# EAGLE design relay board (EAGLE 6.3)
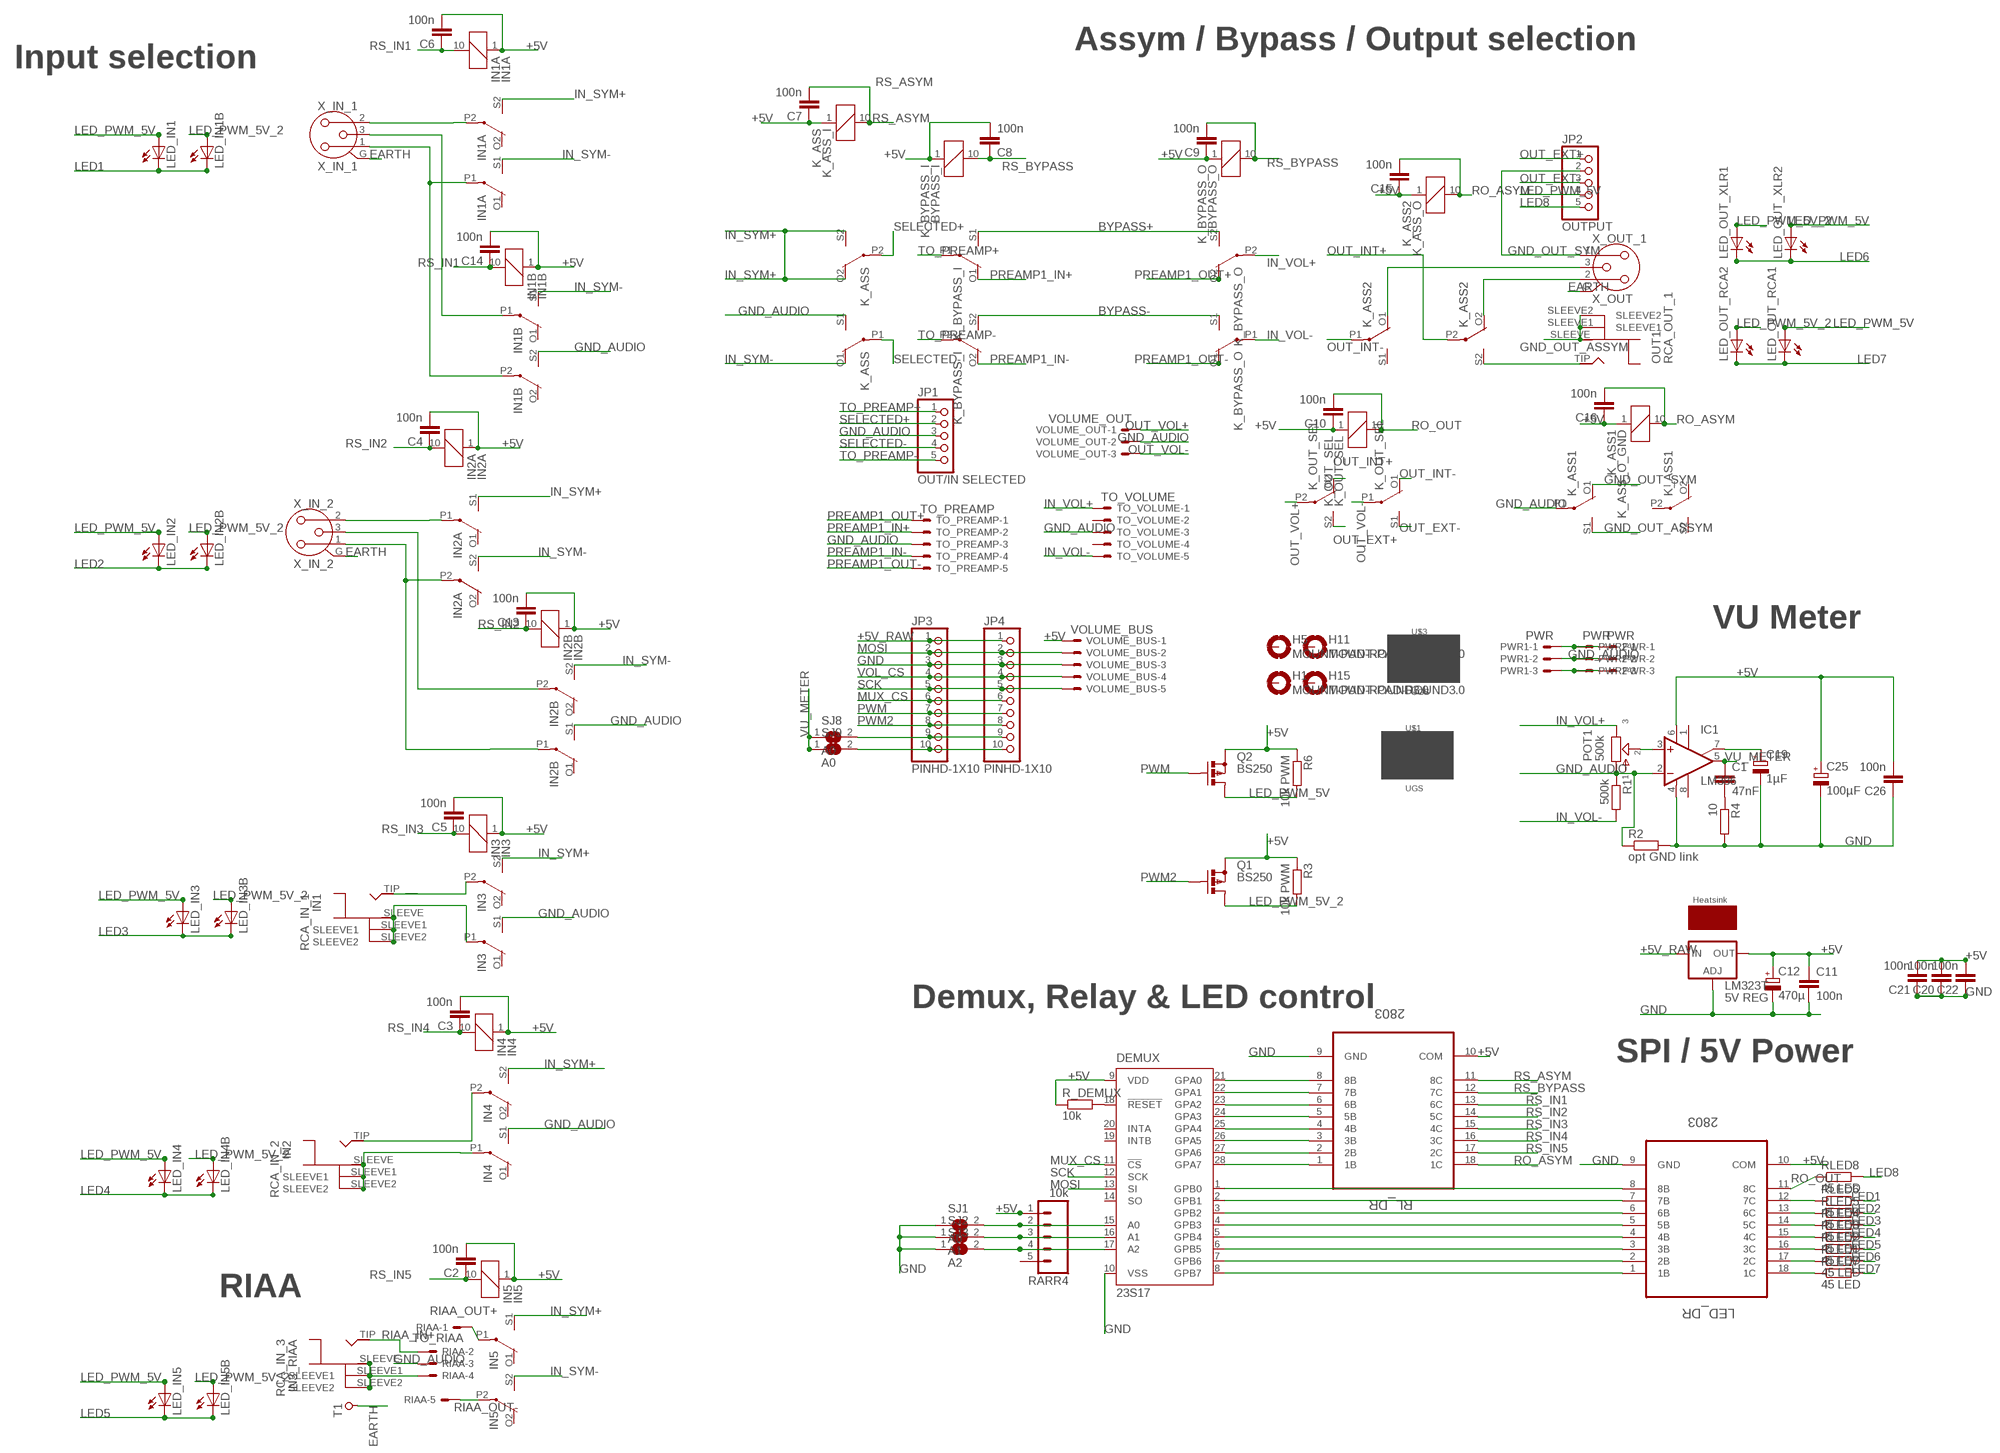
[diagram p0: schematic, sheet 1]

## Parts
C1  47nF  C5/3  [C5B3]
C2  100n  C-EU050-025X075  [C050-025X075]
C3  100n  C-EU050-025X075  [C050-025X075]
C4  100n  C-EU050-025X075  [C050-025X075]
C5  100n  C-EU050-025X075  [C050-025X075]
C6  100n  C-EU050-025X075  [C050-025X075]
C7  100n  C-EU050-025X075  [C050-025X075]
C8  100n  C-EU050-025X075  [C050-025X075]
C9  100n  C-EU050-025X075  [C050-025X075]
C10  100n  C-EU050-025X075  [C050-025X075]
C11  100n  C-EU050-025X075  [C050-025X075]
C12  470µ  CPOL-EUE2.5-6  [E2,5-6]
C13  100n  C-EU050-025X075  [C050-025X075]
C14  100n  C-EU050-025X075  [C050-025X075]
C15  100n  C-EU050-025X075  [C050-025X075]
C16  100n  C-EU050-025X075  [C050-025X075]
C19  1µF  CPOL-EUE2.5-5  [E2,5-5]
C20  100n  C-EU050-025X075  [C050-025X075]
C21  100n  C-EU050-025X075  [C050-025X075]
C22  100n  C-EU050-025X075  [C050-025X075]
C25  100µF  CPOL-EUE5-6  [E5-6]
C26  100n  C-EU050-025X075  [C050-025X075]
DEMUX  23S17  MCP23S17SO  [SO28W]
H1  MOUNT-PAD-ROUND3.0  [3,0-PAD]
H5  MOUNT-PAD-ROUND3.0  [3,0-PAD]
H11  MOUNT-PAD-ROUND3.0  [3,0-PAD]
H15  MOUNT-PAD-ROUND3.0  [3,0-PAD]
IC1  LM386  [DIL08]
IN1A  IN1A  G6H2-100  [G6H2-100]
IN1B  IN1B  G6H2-100  [G6H2-100]
IN2A  IN2A  G6H2-100  [G6H2-100]
IN2B  IN2B  G6H2-100  [G6H2-100]
IN3  IN3  G6H2-100  [G6H2-100]
IN4  IN4  G6H2-100  [G6H2-100]
IN5  IN5  G6H2-100  [G6H2-100]
JP1  OUT/IN SELECTED  PINHD-1X5  [1X05]
JP2  OUTPUT  PINHD-1X5  [1X05]
JP3  PINHD-1X10  [1X10-BIG]
JP4  PINHD-1X10  [1X10-BIG]
K_ASS  K_ASS_I  G6H2-100  [G6H2-100]
K_ASS1  K_ASS_O_GND  G6H2-100  [G6H2-100]
K_ASS2  K_ASS_O  G6H2-100  [G6H2-100]
K_BYPASS_I  BYPASS_I  G6H2-100  [G6H2-100]
K_BYPASS_O  BYPASS_O  G6H2-100  [G6H2-100]
K_OUT_SEL  K_OUT_SEL  G6H2-100  [G6H2-100]
LED_DR  2803  ULN2803ADWR  [SOIC127P1030X265-18N]
LED_IN1  TLLG4400  [LED3MM]
LED_IN1B  TLLG4400  [LED3MM]
LED_IN2  TLLG4400  [LED3MM]
LED_IN2B  TLLG4400  [LED3MM]
LED_IN3  TLLG4400  [LED3MM]
LED_IN3B  TLLG4400  [LED3MM]
LED_IN4  TLLG4400  [LED3MM]
LED_IN4B  TLLG4400  [LED3MM]
LED_IN5  TLLG4400  [LED3MM]
LED_IN5B  TLLG4400  [LED3MM]
LED_OUT_RCA1  TLLG4400  [LED3MM]
LED_OUT_RCA2  TLLG4400  [LED3MM]
LED_OUT_XLR1  TLLG4400  [LED3MM]
LED_OUT_XLR2  TLLG4400  [LED3MM]
LM323T  5V REG  LM138-TSTO220S_IAO  [TO220S]
POT1  500k  POT-EU25  [B25P]
PWR  PWR  C-GRID-03-70543  [70543-03]
PWR1  PWR  C-GRID-03-70543  [70543-03]
PWR2  PWR  C-GRID-03-70543  [70543-03]
Q1  BS250  [SOT54E]
Q2  BS250  [SOT54E]
R1  500k  R-EU_0207/7  [0207/7]
R2  opt GND link  R-EU_0207/10  [0207/10]
R3  10k PWM  R-EU_0207/10  [0207/10]
R4  10  R-EU_0207/10  [0207/10]
R6  10k PWM  R-EU_0207/10  [0207/10]
R_DEMUX  10k  RESISTOR-PTH-0.4  [RTH025W]
RARR4  10k  M05PTH  [1X05]
RCA_IN_1  IN1  MONO_JACKGAEL  [MONO_JACK]
RCA_IN_2  IN2  MONO_JACKGAEL  [MONO_JACK]
RCA_IN_3  IN3_RIAA  MONO_JACKGAEL  [MONO_JACK]
RCA_OUT_1  OUT1  MONO_JACKGAEL  [MONO_JACK]
RIAA  TO_RIAA  C-GRID-05-70543  [70543-05]
RL_DR  2803  ULN2803ADWR  [SOIC127P1030X265-18N]
RLED1  45 LED  R-EU_0207/10  [0207/10]
RLED2  45 LED  R-EU_0207/10  [0207/10]
RLED3  45 LED  R-EU_0207/10  [0207/10]
RLED4  45 LED  R-EU_0207/10  [0207/10]
RLED5  45 LED  R-EU_0207/10  [0207/10]
RLED6  45 LED  R-EU_0207/10  [0207/10]
RLED7  45 LED  R-EU_0207/10  [0207/10]
RLED8  45 LED  R-EU_0207/10  [0207/10]
SJ1  A0  SJ  [SJ]
SJ2  A1  SJ  [SJ]
SJ3  A2  SJ  [SJ]
SJ8  A0  SJ  [SJ]
SJ9  A0  SJ  [SJ]
T1  PAD_TERMINAL-1.02MM_SQUARE  [CON_PAD_SQUARE_1.02MM]
TO_PREAMP  TO_PREAMP  C-GRID-05-70543  [70543-05]
TO_VOLUME  TO_VOLUME  C-GRID-05-70543  [70543-05]
U$1  UGS  [UGS]
U$3  UGS  [UGS]
U$4  HEATSINK  [HEATSINK]
VOLUME_BUS  VOLUME_BUS  C-GRID-05-70543  [70543-05]
VOLUME_OUT  VOLUME_OUT  C-GRID-03-70543  [70543-03]
X_IN_1  X_IN_1  NC3FAH2  [NC3FAH2]
X_IN_2  X_IN_2  NC3FAH2  [NC3FAH2]
X_OUT_1  X_OUT  NC3MBH  [NC3MBH]

## Nets
+5V [power]: C2.2 C3.2 C4.2 C5.2 C6.2 C7.1 C8.2 C9.1 C10.1 C11.1 C12.+ C13.2 C14.2 C15.1 C16.1 C20.2 C21.2 C22.2 C25.+ C26.2 DEMUX.9(VDD) IC1.6(V+) IN1A.1 IN1B.1 IN2A.1 IN2B.1 IN3.1 IN4.1 IN5.1 K_ASS1.1 K_ASS2.1 K_ASS.1 K_BYPASS_I.1 K_BYPASS_O.1 K_OUT_SEL.1 LED_DR.10(COM) LM323T.3(OUT) Q1.S Q2.S R3.1 R6.1 R_DEMUX.1 RARR4.1 RL_DR.10(COM) VOLUME_BUS.1
+5V_RAW [power]: JP3.1 JP4.1 LM323T.1(IN)
BYPASS+ [power]: K_BYPASS_I.S1(2:S) K_BYPASS_O.S2(3:S)
BYPASS- [power]: K_BYPASS_I.S2(3:S) K_BYPASS_O.S1(2:S)
EARTH: T1.P X_IN_1.G X_IN_2.G X_OUT_1.G
GND [power]: C11.2 C12.- C19.- C20.1 C21.1 C22.1 C25.- C26.1 DEMUX.10(VSS) IC1.4(V-) JP3.3 JP4.3 LED_DR.9(GND) LM323T.2(ADJ) R2.2 R4.2 RL_DR.9(GND) SJ1.1 SJ2.1 SJ3.1 VOLUME_BUS.3
GND_AUDIO [power]: IC1.2(-IN) IN1B.S2(3:S) IN2B.S1(2:S) IN3.S1(2:S) IN4.S1(2:S) JP1.3 K_ASS1.P1(2:P) K_ASS.S1(2:S) POT1.1 PWR1.2 PWR2.2 PWR.2 R1.1 R2.1 RIAA.3 TO_PREAMP.3 TO_VOLUME.3 VOLUME_OUT.2
GND_IN_RIAA [power]: RCA_IN_3.SLEEVE RCA_IN_3.SLEEVE1 RCA_IN_3.SLEEVE2 RIAA.4
GND_OUT_ASSYM [power]: K_ASS1.S1(2:S) RCA_OUT_1.SLEEVE RCA_OUT_1.SLEEVE1 RCA_OUT_1.SLEEVE2
GND_OUT_SYM [power]: JP2.2 K_ASS1.O1(2:O) X_OUT_1.1
IN_SYM+ [power]: IN1A.S2(3:S) IN2A.S1(2:S) IN3.S2(3:S) IN4.S2(3:S) IN5.S1(2:S) K_ASS.O2(3:O) K_ASS.S2(3:S)
IN_SYM- [power]: IN1A.S1(2:S) IN1B.S1(2:S) IN2A.S2(3:S) IN2B.S2(3:S) IN5.S2(3:S) K_ASS.O1(2:O)
IN_VOL+ [power]: K_BYPASS_O.P2(3:P) POT1.3 TO_VOLUME.1
IN_VOL- [power]: K_BYPASS_O.P1(2:P) R1.2 TO_VOLUME.5
LED1: LED_IN1.K(C) LED_IN1B.K(C) RLED6.2
LED2: LED_IN2.K(C) LED_IN2B.K(C) RLED5.2
LED3: LED_IN3.K(C) LED_IN3B.K(C) RLED4.2
LED4: LED_IN4.K(C) LED_IN4B.K(C) RLED3.2
LED5: LED_IN5.K(C) LED_IN5B.K(C) RLED2.2
LED6: LED_OUT_XLR1.K(C) LED_OUT_XLR2.K(C) RLED1.2
LED7: LED_OUT_RCA1.K(C) LED_OUT_RCA2.K(C) RLED7.2
LED8: JP2.5 RLED8.2
LED_PWM_5V [power]: JP2.4 LED_IN1.A LED_IN2.A LED_IN3.A LED_IN4.A LED_IN5.A LED_OUT_RCA1.A LED_OUT_XLR2.A Q2.D R6.2
LED_PWM_5V_2 [power]: LED_IN1B.A LED_IN2B.A LED_IN3B.A LED_IN4B.A LED_IN5B.A LED_OUT_RCA2.A LED_OUT_XLR1.A Q1.D R3.2
MOSI: DEMUX.13(SI) JP3.2 JP4.2 VOLUME_BUS.2
MUX_CS: DEMUX.11(!CS) JP3.6 JP4.6
N$1: DEMUX.18(!RESET) R_DEMUX.2
N$2: LED_DR.17(2C) RLED1.1
N$3 [power]: IN3.P2(3:P) RCA_IN_1.TIP
N$4: C1.2 R4.1
N$5 [power]: PWR1.1 PWR2.1 PWR.1
N$6: LED_DR.18(1C) RLED7.1
N$7: IC1.3(+IN) POT1.2
N$8: LED_DR.16(3C) RLED2.1
N$9: C19.+ IC1.7(BYPASS)
N$10: JP3.10 JP4.10 SJ9.2
N$11: DEMUX.8(GPB7) LED_DR.1(1B)
N$12: DEMUX.7(GPB6) LED_DR.2(2B)
N$13: DEMUX.6(GPB5) LED_DR.3(3B)
N$14: DEMUX.5(GPB4) LED_DR.4(4B)
N$15: DEMUX.4(GPB3) LED_DR.5(5B)
N$16: DEMUX.3(GPB2) LED_DR.6(6B)
N$17: DEMUX.2(GPB1) LED_DR.7(7B)
N$18: DEMUX.1(GPB0) LED_DR.8(8B)
N$19: LED_DR.15(4C) RLED3.1
N$20 [power]: PWR1.3 PWR2.3 PWR.3
N$21 [power]: IN4.P1(2:P) RCA_IN_2.SLEEVE RCA_IN_2.SLEEVE1 RCA_IN_2.SLEEVE2
N$22 [power]: IN2A.P1(2:P) X_IN_2.2
N$23 [power]: IN2B.P2(3:P) X_IN_2.3
N$24 [power]: IN2A.P2(3:P) IN2B.P1(2:P) X_IN_2.1
N$25: LED_DR.14(5C) RLED4.1
N$26: LED_DR.13(6C) RLED5.1
N$27: LED_DR.12(7C) RLED6.1
N$29 [power]: IN4.P2(3:P) RCA_IN_2.TIP
N$30: DEMUX.15(A0) RARR4.2 SJ1.2
N$31: DEMUX.16(A1) RARR4.3 SJ2.2
N$32 [power]: IN3.P1(2:P) RCA_IN_1.SLEEVE RCA_IN_1.SLEEVE1 RCA_IN_1.SLEEVE2
N$33 [power]: IN1A.P2(3:P) X_IN_1.2
N$34 [power]: IN1B.P1(2:P) X_IN_1.3
N$35: DEMUX.17(A2) RARR4.4 SJ3.2
N$40 [power]: IN1A.P1(2:P) IN1B.P2(3:P) X_IN_1.1
N$42 [power]: K_ASS2.O2(3:O) X_OUT_1.2
N$55 [power]: K_ASS2.S2(3:S) RCA_OUT_1.TIP
N$56: DEMUX.21(GPA0) RL_DR.8(8B)
N$59: DEMUX.22(GPA1) RL_DR.7(7B)
N$65: DEMUX.23(GPA2) RL_DR.6(6B)
N$67: DEMUX.24(GPA3) RL_DR.5(5B)
N$68: DEMUX.25(GPA4) RL_DR.4(4B)
N$69: DEMUX.26(GPA5) RL_DR.3(3B)
N$70: DEMUX.27(GPA6) RL_DR.2(2B)
N$71: DEMUX.28(GPA7) RL_DR.1(1B)
N$72 [power]: K_ASS2.O1(2:O) X_OUT_1.3
N$83: JP3.9 JP4.9 SJ8.2
OUT_EXT+ [power]: JP2.1 K_OUT_SEL.S2(3:S)
OUT_EXT- [power]: JP2.3 K_OUT_SEL.S1(2:S)
OUT_INT+ [power]: K_ASS2.P2(3:P) K_OUT_SEL.O2(3:O)
OUT_INT- [power]: K_ASS2.P1(2:P) K_OUT_SEL.O1(2:O)
OUT_VOL+ [power]: K_OUT_SEL.P2(3:P) VOLUME_OUT.1
OUT_VOL- [power]: K_OUT_SEL.P1(2:P) VOLUME_OUT.3
PREAMP1_IN+ [power]: K_BYPASS_I.O1(2:O) TO_PREAMP.2
PREAMP1_IN- [power]: K_BYPASS_I.O2(3:O) TO_PREAMP.4
PREAMP1_OUT+ [power]: K_BYPASS_O.O2(3:O) TO_PREAMP.1
PREAMP1_OUT- [power]: K_BYPASS_O.O1(2:O) TO_PREAMP.5
PWM: JP3.7 JP4.7 Q2.G
PWM2: JP3.8 JP4.8 Q1.G
RIAA_IN+ [power]: RCA_IN_3.TIP RIAA.2
RIAA_OUT+ [power]: IN5.P1(2:P) RIAA.1
RIAA_OUT- [power]: IN5.P2(3:P) RIAA.5
RO_ASYM: C15.2 C16.2 K_ASS1.10 K_ASS2.10 RL_DR.18(1C)
RO_OUT: C10.2 K_OUT_SEL.10 LED_DR.11(8C) RLED8.1
RS_ASYM: C7.2 K_ASS.10 RL_DR.11(8C)
RS_BYPASS: C8.1 C9.2 K_BYPASS_I.10 K_BYPASS_O.10 RL_DR.12(7C)
RS_IN1: C6.1 C14.1 IN1A.10 IN1B.10 RL_DR.13(6C)
RS_IN2: C4.1 C13.1 IN2A.10 IN2B.10 RL_DR.14(5C)
RS_IN3: C5.1 IN3.10 RL_DR.15(4C)
RS_IN4: C3.1 IN4.10 RL_DR.16(3C)
RS_IN5: C2.1 IN5.10 RL_DR.17(2C)
SCK: DEMUX.12(SCK) JP3.5 JP4.5 VOLUME_BUS.5
SELECTED+ [power]: JP1.2 K_ASS.P2(3:P)
SELECTED- [power]: JP1.4 K_ASS.P1(2:P)
TO_PREAMP+ [power]: JP1.1 K_BYPASS_I.P1(2:P)
TO_PREAMP- [power]: JP1.5 K_BYPASS_I.P2(3:P)
VOL_CS: JP3.4 JP4.4 VOLUME_BUS.4
VU_METER: C1.1 IC1.5(OUT) SJ8.1 SJ9.1
Unconnected: DEMUX.14(SO) DEMUX.19(INTB) DEMUX.20(INTA) H1.B3,0(MOUNT) H5.B3,0(MOUNT) H11.B3,0(MOUNT) H15.B3,0(MOUNT) IC1.1(GAIN1) IC1.8(GAIN2) IN1A.O1(2:O) IN1A.O2(3:O) IN1B.O1(2:O) IN1B.O2(3:O) IN2A.O1(2:O) IN2A.O2(3:O) IN2B.O1(2:O) IN2B.O2(3:O) IN3.O1(2:O) IN3.O2(3:O) IN4.O1(2:O) IN4.O2(3:O) IN5.O1(2:O) IN5.O2(3:O) K_ASS1.O2(3:O) K_ASS1.P2(3:P) K_ASS1.S2(3:S) K_ASS2.S1(2:S) RARR4.5 TO_VOLUME.2 TO_VOLUME.4

## Notes on the sheet
- Assym / Bypass / Output selection
- Input selection
- VU Meter
- Demux, Relay & LED control
- SPI / 5V Power
- RIAA

## Library data of the parts
C1 = capacitor-wima:C: CAPACITOR naming: grid - package width
C2-C11 C13-C16 C20-C22 C26 = rcl:C-EU: CAPACITOR, European symbol
C12 C19 C25 = rcl:CPOL-EU: POLARIZED CAPACITOR, European symbol
DEMUX = microchip:MCP23S17: http://ww1.microchip.com/downloads/en/DeviceDoc/21952a.pdf Source: http://ww1.microchip.com/downloads/en/DeviceDoc/21952a.pdf; MF: MICROCHIP; MPN: MCP23S17-E/SO; OC_FARNELL: unknown; OC_NEWARK: 31K2950
H1 H5 H11 H15 = holes:MOUNT-PAD-ROUND: MOUNTING PAD, round
IC1 = gm-ics:LM386: LM386 - Low Voltage Audio Power Amplifier
IN1A IN1B IN2A IN2B IN3-IN5 K_ASS K_ASS1 K_ASS2 K_BYPASS_I K_BYPASS_O K_OUT_SEL = relay:G6H2-100: RELAY 2 x switch, 0.5 A/125 V AC, 1 A/30 V DC, Omron; OC_FARNELL: unknown; OC_NEWARK: unknown
JP1 JP2 = pinhead:PINHD-1X5: PIN HEADER
JP3 JP4 = adafruit:PINHD-1X10: Pin header 1x10 0.1" spacing With round pins
LED_DR RL_DR = uln-udn:ULN2803ADWR: Darlington transistor array; MPN: ULN2803ADWR; OC_FARNELL: 1652420; OC_NEWARK: 87H4769; PACKAGE: SOIC-18; SUPPLIER: TEXAS INSTRUMENTS
LED_IN1 LED_IN1B LED_IN2 LED_IN2B LED_IN3 LED_IN3B LED_IN4 LED_IN4B LED_IN5 LED_IN5B LED_OUT_RCA1 LED_OUT_RCA2 LED_OUT_XLR1 LED_OUT_XLR2 = led:TLLG4400: Low Current (2mA) LED 3 mm Tinted Diffused Package color GREEN Source: Data sheet <http://www.farnell.com/datasheets/391098.pdf>; MF: VISHAY SEMICONDUCTOR; OC_FARNELL: 1612435
LM323T = v-reg:LM138-TS: VOLTAGE REGULATOR
POT1 = gm-pots:POT-EU
PWR PWR1 PWR2 VOLUME_OUT = con-molex:C-GRID-03: CONNECTOR wire to board 2.54 mm (0.100") pitch header; OC_FARNELL: unknown; OC_NEWARK: unknown
Q1 Q2 = transistor-small-signal:BS250: P-CHANNEL MOS FET
R1-R4 R6 RLED1-RLED8 = rcl:R-EU_: RESISTOR, European symbol
R_DEMUX = dp_devices.v6:RESISTOR
RARR4 = SparkFun:M05: Header 5 Standard 5-pin 0.1" header. Use with straight break away headers (SKU : PRT-00116), right angle break away headers (PRT-00553), swiss pins (PRT-00743), machine pins (PRT-00117), and female headers (PRT-00115). Molex polarized connector foot print use with SKU : PRT-08230 with associated crimp pins and housings.
RCA_IN_1-RCA_IN_3 RCA_OUT_1 = 00_steve:MONO_JACK
RIAA TO_PREAMP TO_VOLUME VOLUME_BUS = con-molex:C-GRID-05: CONNECTOR wire to board 2.54 mm (0.100") pitch header; OC_FARNELL: unknown; OC_NEWARK: unknown
SJ1-SJ3 SJ8 SJ9 = jumper:SJ: SMD solder JUMPER
T1 = dp_devices:PAD_TERMINAL: Terminal connection pad
U$1 U$3 = gael:UGS
U$4 = gael:HEATSINK
X_IN_1 X_IN_2 = con-neutrik_ag:NC3: Neutrik Audio Connector XLR SERIES Stereo 1/4" jack Source: www.neutrik.com/; MPN: NC3FAH2; OC_FARNELL: unknown; OC_NEWARK: 27B4208
X_OUT_1 = con-neutrik_ag:NC3: Neutrik Audio Connector XLR SERIES Stereo 1/4" jack Source: www.neutrik.com/; MF: NEUTRIK; MPN: NC3MBH; OC_FARNELL: unknown; OC_NEWARK: 91F3470

## Net classes
0 default: width 0.203 mm, clearance 0.203 mm
1 mains: width 0.508 mm, clearance 2.5 mm
2 earth: width 1.27 mm, clearance 0.508 mm
3 main2: width 0.508 mm, clearance 1.5 mm
4 power: width 0.381 mm, clearance 0.203 mm

## Board
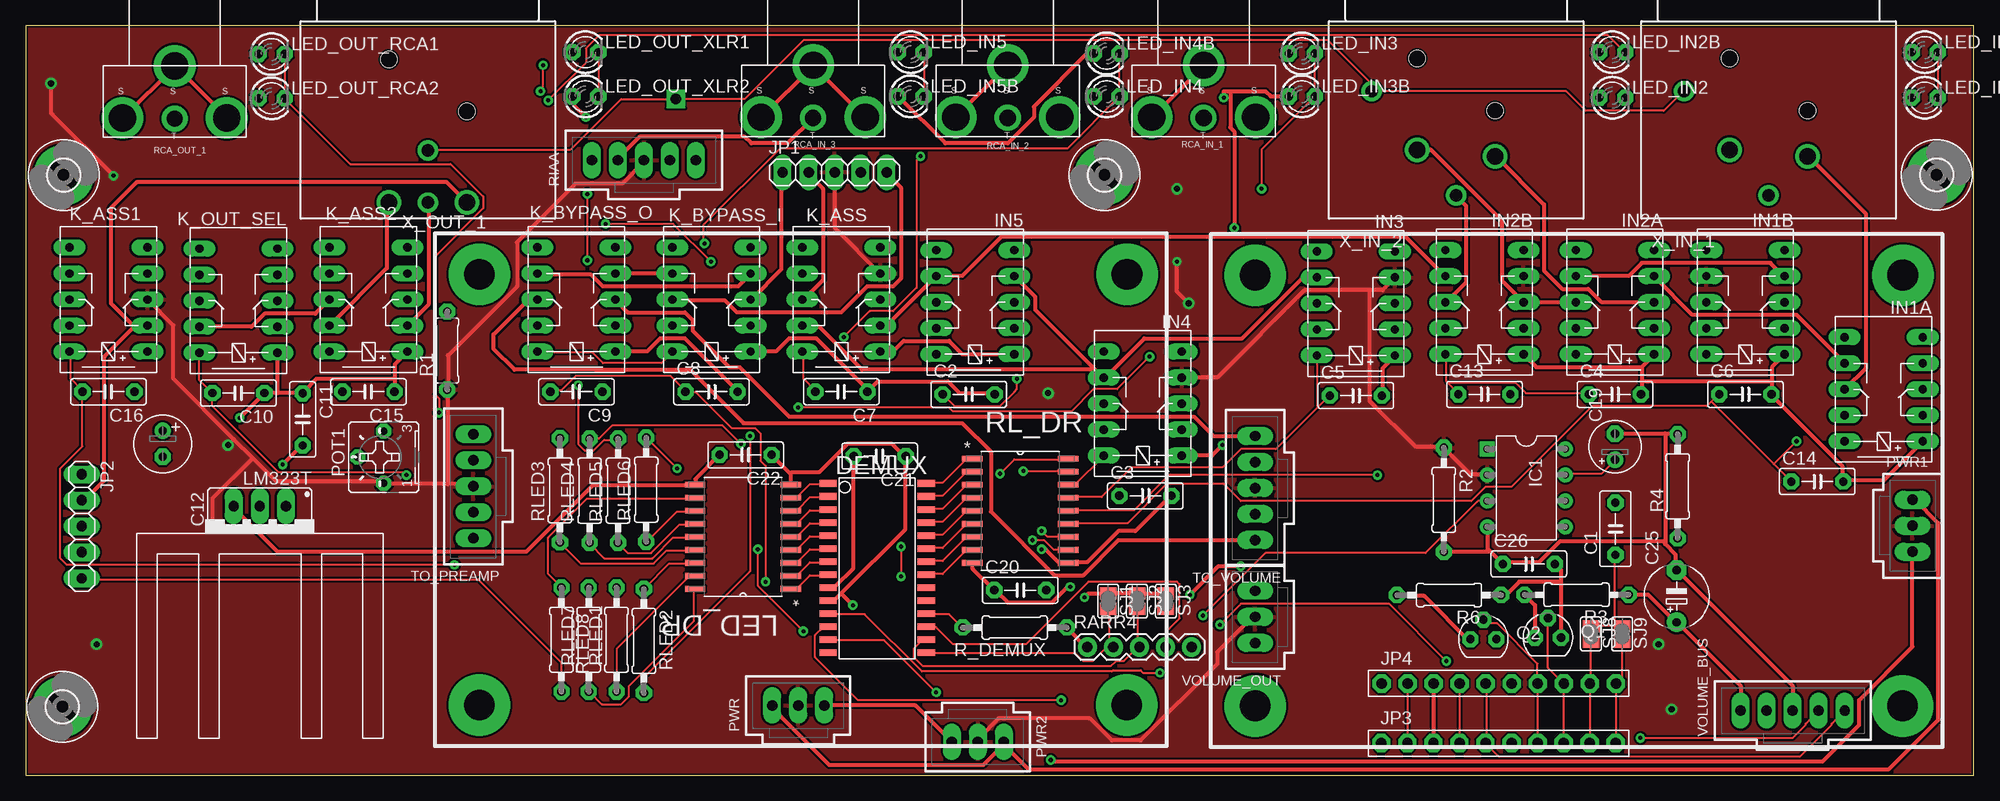
[diagram p1: board, top side]
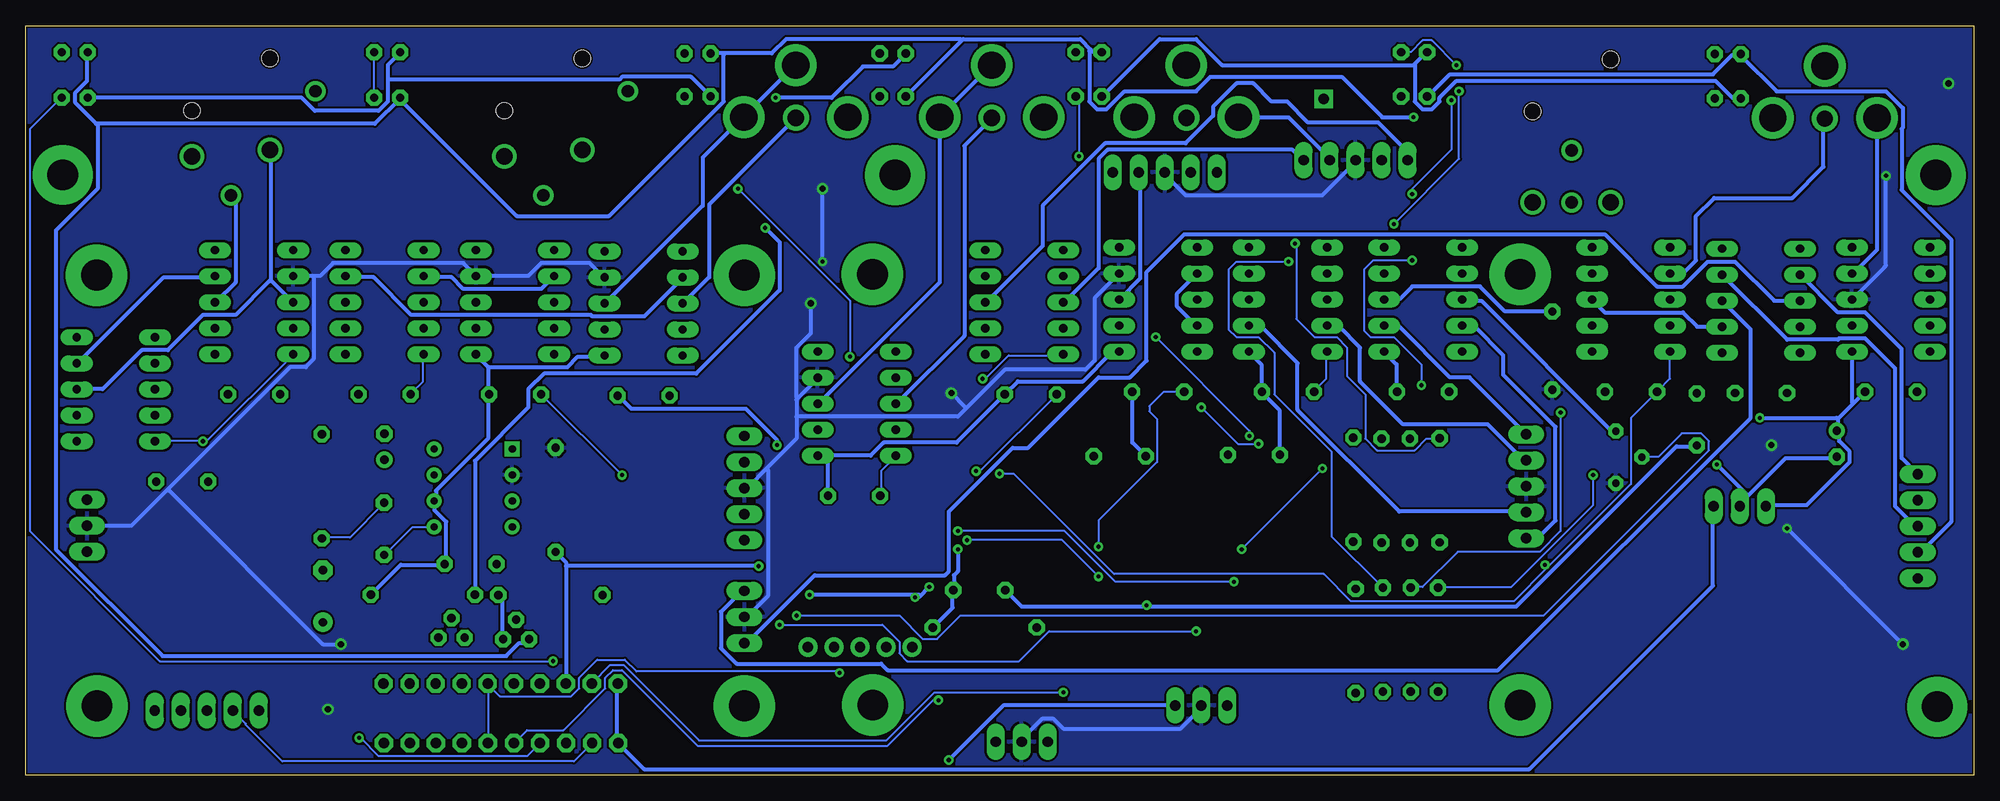
[diagram p2: board, bottom side, seen from below]

Size 190.08 x 73.15 mm. Coordinates in mm from the lower left corner, seen from the top.
Outline: 0,0 190.08,0 190.08,73.15 0,73.15 0,0
Copper layers (1*16): Top 0.035mm / dielectric 1.5mm / Bottom 0.035mm
Design rules "gael design rules *": minimum track width 0.2mm, minimum drill 0.4mm, track to track 8mil, track to pad 8mil, pad to pad 8mil, via to via 8mil, smd to smd 8mil, copper to edge 0.2mm, drill to drill 0.2mm, minimum pad ring 15mil, minimum via ring 10mil, stop-mask expansion 4mil, vias tented up to drill 0mil, thermal gap 10mil

### Footprints (pad centres in the part's own frame; a part is rotated, then mirrored left to right if it is on the bottom)
C5B3 = drill 0.813 pad 1.6 octagon: 1 -2.54,0; 2 2.54,0
C050-025X075 = drill 0.813 octagon: 1 -2.54,0; 2 2.54,0
E2,5-6 = drill 0.813 pad 1.6: + -1.27,0 | drill 0.813 pad 1.6 octagon: - 1.27,0
E2,5-5 = drill 0.813 pad 1.6: + -1.27,0 | drill 0.813 pad 1.6 octagon: - 1.27,0
E5-6 = drill 0.813 pad 1.905: + -2.54,0 | drill 0.813 pad 1.905 octagon: - 2.54,0
SO28W = smd 0.65 x 1.7: 1 -7.62,-4.78; 2 -6.35,-4.78; 3 -5.08,-4.78; 4 -3.81,-4.78; 5 -2.54,-4.78; 6 -1.27,-4.78; 7 0,-4.78; 8 1.27,-4.78; 9 2.54,-4.78; 10 3.81,-4.78; 11 5.08,-4.78; 12 6.35,-4.78; 13 7.62,-4.78; 14 8.89,-4.78; 15 8.89,4.78; 16 7.62,4.78; 17 6.35,4.78; 18 5.08,4.78; 19 3.81,4.78; 20 2.54,4.78; 21 1.27,4.78; 22 0,4.78; 23 -1.27,4.78; 24 -2.54,4.78; 25 -3.81,4.78; 26 -5.08,4.78; 27 -6.35,4.78; 28 -7.62,4.78
3,0-PAD = drill 3 pad 5.842: B3,0 0,0
DIL08 = drill 0.7 square: 1 -3.81,-3.81 | drill 0.7: 2 -1.27,-3.81; 3 1.27,-3.81; 4 3.81,-3.81; 5 3.81,3.81; 6 1.27,3.81; 7 -1.27,3.81; 8 -3.81,3.81
G6H2-100 = drill 0.813 long: 1 -5.08,-3.81; 5 5.08,-3.81; 6 5.08,3.81; 10 -5.08,3.81; O1 -2.54,-3.81; O2 -2.54,3.81; P1 0,-3.81; P2 0,3.81; S1 2.54,-3.81; S2 2.54,3.81
1X05 = drill 1.016 long: 1 -5.08,0; 2 -2.54,0; 3 0,0; 4 2.54,0; 5 5.08,0
1X10-BIG = drill 1.016 pad 1.778 octagon: 1 -11.43,0; 2 -8.89,0; 3 -6.35,0; 4 -3.81,0; 5 -1.27,0; 6 1.27,0; 7 3.81,0; 8 6.35,0; 9 8.89,0; 10 11.43,0
SOIC127P1030X265-18N = smd 1.981 x 0.559: 1 -4.674,5.08; 2 -4.674,3.81; 3 -4.674,2.54; 4 -4.674,1.27; 5 -4.674,0; 6 -4.674,-1.27; 7 -4.674,-2.54; 8 -4.674,-3.81; 9 -4.674,-5.08; 10 4.674,-5.08; 11 4.674,-3.81; 12 4.674,-2.54; 13 4.674,-1.27; 14 4.674,0; 15 4.674,1.27; 16 4.674,2.54; 17 4.674,3.81; 18 4.674,5.08
LED3MM = drill 0.813 octagon: A -1.27,0; K 1.27,0
TO220S = drill 1.016 long: 1 -2.54,-2.54; 2 0,-2.54; 3 2.54,-2.54
B25P = drill 0.7 octagon: 1 -2.54,0; 2 0,2.54; 3 2.54,0
70543-03 = drill 1.016 long: 1 -2.54,0; 2 0,0; 3 2.54,0
SOT54E = drill 0.813 octagon: D -1.27,0; G 0,1.905; S 1.27,0
0207/7 = drill 0.813 octagon: 1 -3.81,0; 2 3.81,0
0207/10 = drill 0.813 octagon: 1 -5.08,0; 2 5.08,0
RTH025W = drill 0.813 octagon: 1 -5.08,0; 2 5.08,0
1X05' = drill 1.016 pad 1.88: 1 0,0; 2 2.54,0; 3 5.08,0; 4 7.62,0; 5 10.16,0
MONO_JACK = drill 2.667 pad 4.064: SLEEVE 7.62,0; SLEEVE1 -2.54,0; SLEEVE2 2.54,-5.08 | drill 1.575 pad 2.54: TIP 2.54,0.064
70543-05 = drill 1.016 long: 1 -5.08,0; 2 -2.54,0; 3 0,0; 4 2.54,0; 5 5.08,0
SJ = smd 1.168 x 1.6: 1 -0.762,0; 2 0.762,0
CON_PAD_SQUARE_1.02MM = drill 1.02 pad 1.81 square: P 0,0
UGS = drill 3 pad 6: P$1 23.165,-12.497; P$2 23.19,29.54; P$3 -40.005,29.54; P$4 -40.005,-12.497
NC3FAH2 = drill 1.6: 1 -3.81,0.635; 2 3.81,0 | drill 1.2: 3 0,-3.815; G -8.25,6.355 | hole 1.6: -3.81,9.525; 3.81,4.445
NC3MBH = drill 1.6: 1 3.81,0; 2 -3.81,0 | drill 1.2: 3 0,0; G 0,5.08 | hole 1.6: -3.81,13.97; 3.81,8.89

### Placement (x,y rotation side)
C1  155.11,24.04 90 top
C2  92.01,37.16 0 top
C3  109.25,27.26 0 top
C4  155.06,37.16 0 top
C5  129.79,37.04 0 top
C6  167.79,37.16 0 top
C7  79.59,37.42 180 top
C8  66.92,37.42 0 top
C9  53.74,37.42 180 top
C10  20.76,37.29 180 top
C11  27.03,34.72 270 top
C12  13.38,32.33 270 top
C13  142.33,37.16 0 top
C14  174.8,28.65 0 top
C15  33.45,37.42 180 top
C16  8.08,37.42 180 top
C19  155.06,32.04 90 top
C20  97.04,18.05 0 top
C21  83.32,31.13 180 top
C22  70.24,31.26 180 top
C25  161.08,17.45 90 top
C26  146.66,20.61 0 top
DEMUX  83.07,20.84 270 top
H1  3.58,6.68 0 top
H5  105.26,58.57 0 top
H11  186.45,58.59 0 top
H15  3.71,58.57 0 top
IC1  146.41,28.04 270 top
IN1A  181.28,37.65 90 top
IN1B  167.79,46.16 90 top
IN2A  155.06,46.16 90 top
IN2B  142.33,46.16 90 top
IN3  129.79,46.04 90 top
IN4  108.99,36.26 90 top
IN5  92.64,46.16 90 top
JP1  78.93,58.83 0 top
JP2  5.47,24.28 270 top
JP3  143.7,3.12 0 top
JP4  143.73,8.94 0 top
K_ASS  79.59,46.42 90 top
K_ASS1  8.08,46.42 90 top
K_ASS2  33.45,46.42 90 top
K_BYPASS_I  66.92,46.42 90 top
K_BYPASS_O  53.74,46.42 90 top
K_OUT_SEL  20.76,46.3 90 top
LED_DR  69.99,23.26 180 top
LED_IN1  185.29,70.56 0 top
LED_IN1B  185.29,66.12 0 top
LED_IN2  154.81,66.12 0 top
LED_IN2B  154.81,70.56 0 top
LED_IN3  124.52,70.43 0 top
LED_IN3B  124.52,66.24 0 top
LED_IN4  105.47,66.24 0 top
LED_IN4B  105.47,70.43 0 top
LED_IN5  86.36,70.56 0 top
LED_IN5B  86.36,66.24 0 top
LED_OUT_RCA1  24,70.37 0 top
LED_OUT_RCA2  24,66.05 0 top
LED_OUT_XLR1  54.61,70.56 0 top
LED_OUT_XLR2  54.61,66.24 0 top
LM323T  22.84,23.7 180 top
POT1  34.94,31.03 90 top
PWR  75.37,6.81 0 top
PWR1  184.09,24.33 270 top
PWR2  92.9,3.25 180 top
Q1  148.53,13.41 0 top
Q2  142.23,13.26 0 top
R1  41.13,41.43 90 top
R2  138.37,26.87 270 top
R3  151.32,17.6 180 top
R4  161.18,28.19 90 top
R6  138.87,17.58 180 top
R_DEMUX  96.51,14.4 180 top
RARR4  10k  [1X05']  103.59,12.5 0 top
RCA_IN_1  117.47,64.21 180 top
RCA_IN_2  98.36,64.21 180 top
RCA_IN_3  79.38,64.21 180 top
RCA_OUT_1  17.08,64.15 180 top
RIAA  60.33,60.02 0 top
RL_DR  97.04,25.8 0 top
RLED1  57.65,13.22 90 top
RLED2  60.31,13.1 270 top
RLED3  52.12,27.8 90 top
RLED4  55.02,27.76 90 top
RLED5  57.79,27.76 90 top
RLED6  60.54,27.86 90 top
RLED7  54.94,13.22 90 top
RLED8  52.28,13.22 270 top
SJ1  105.62,16.98 270 top
SJ2  108.43,16.98 270 top
SJ3  111.25,16.98 270 top
SJ8  152.72,13.78 270 top
SJ9  155.77,13.78 270 top
T1  63.44,65.99 0 top
TO_PREAMP  43.68,28.19 90 top
TO_VOLUME  119.95,28.02 90 top
U$1  159.96,19.25 0 top
U$3  84.26,19.34 0 top
U$4  22.86,23.6 0 top
VOLUME_BUS  172.4,6.3 0 top
VOLUME_OUT  119.95,15.44 90 top
X_IN_1  170.05,60.4 0 top
X_IN_2  139.57,60.4 0 top
X_OUT_1  39.24,55.89 0 top

### Tracks (layer width: path | path; a pad name or v marks a point on that pad's centre or on a via)
+5V  (via drill 0.4)
  Top 0.381: R_DEMUX.1 101.66,14.3 103.57,12.4 RARR4.1 | IN1A.1 184.98,32.46 181.29,28.78 177.36,28.78 C14.2 177.23,28.91 177.23,30.18 170.37,37.03 C6.2 170.37,37.29 170.37,38.43 | 157.67,39.83 157.67,38.43 | 157.67,38.43 157.67,37.29 C4.2 | 157.67,39.83 158.81,40.97 IN2A.1 | 170.37,38.43 170.37,39.83 171.51,40.97 IN1B.1 | 157.67,38.43 157.8,38.43 170.24,38.43 170.37,38.43 | C5.2 132.4,37.16 132.4,39.7 133.54,40.84 IN3.1 | 157.67,39.83 157.54,39.83 147.38,39.83 146.24,40.97 IN2B.1 | 36,38.68 36,40.08 37.15,41.22 K_ASS2.1 | 36,38.68 36,37.54 C15.1 | 24.57,37.29 26.99,37.29 C11.1 27.11,37.41 28.38,38.68 35.88,38.68 36,38.68 | 24.57,37.29 C10.1 23.18,37.16 v20.89,34.87 | K_OUT_SEL.1 24.57,37.41 24.57,37.29 | C3.2 111.7,27.25 108.27,23.83 106.62,23.83 103.57,20.78 101.79,20.78 RL_DR.10 101.54,20.78 100.77,20.78 99.5,22.05 v99.12,22.05 | C22.2 67.63,31.19 65.34,28.91 65.34,28.4 LED_DR.10 65.21,28.27 55.31,28.27 48.83,21.79 24.57,21.79 20.38,25.98 20.38,26.24 LM323T.3 | K_BYPASS_O.1 57.59,41.35 60.64,41.35 61.91,42.62 64.33,42.62 69.41,37.54 C8.2 | DEMUX.9 78.3,18.36 78.93,18.36 80.71,20.14 80.71,31.06 C21.2 | C2.2 94.42,37.29 91.12,37.29 89.98,38.43 83.12,38.43 82.23,37.54 C7.1 82.11,37.67 77.15,42.62 74.49,42.62 73.22,41.35 70.8,41.35 K_BYPASS_I.1 | IN5.1 96.33,41.1 91.38,41.1 90.11,42.37 85.66,42.37 84.65,41.35 83.5,41.35 K_ASS.1 | 149.8,18.87 149.8,20.02 149.29,20.52 C26.2 | 149.8,18.87 Q1.S | R6.1 143.95,17.6 144.46,17.6 145.73,18.87 149.67,18.87 149.8,18.87 | R3.1 158.31,17.6 160.97,14.94 C25.+ 161.23,14.81 167.32,8.71 VOLUME_BUS.1 | v116.78,32.21 115.76,31.19 112.84,31.19 IN4.1
  Bottom 0.381: 144.97,39.83 144.97,37.29 C13.2 144.97,37.03 144.97,32.84 150.05,27.76 150.05,26.87 IC1.6 150.18,26.75 150.18,25.86 149.03,24.71 149.03,20.78 149.16,20.65 C26.2 149.29,20.52 153.48,20.52 R3.1 | 144.97,39.83 146.11,40.97 IN2B.1 | IN3.1 133.67,40.84 136.21,40.84 137.22,39.83 144.84,39.83 144.97,39.83 | R_DEMUX.1 101.54,14.43 99.63,16.33 99.63,17.98 C20.2 99.5,18.11 99.5,19.51 99.12,19.89 v99.12,22.05 | C9.1 56.32,37.54 56.32,40.08 57.47,41.22 K_BYPASS_O.1 | K_BYPASS_I.1 70.68,41.22 69.53,40.08 69.53,37.54 C8.2 69.41,37.29 67.75,35.64 67.75,31.32 C22.2 | C7.1 82.11,37.41 82.11,32.46 80.84,31.19 C21.2 | K_ASS.1 83.5,41.22 84.14,41.22 86.93,38.43 93.28,38.43 94.42,37.29 C2.2 94.68,37.03 99.25,32.46 106.36,32.46 107.63,31.19 112.71,31.19 IN4.1 111.82,31.06 111.82,27.38 C3.2 | 13.27,34.75 13.27,33.6 C12.+ 13.14,33.48 13.14,32.59 12.13,31.57 12.13,30.56 16.32,26.37 20.26,26.37 LM323T.3 | 11.75,36.27 10.73,37.29 C16.1 | 11.75,36.27 13.27,34.75 | Q2.S 143.57,13.03 143.57,17.09 143.95,17.48 R6.1 | v116.78,32.21 116.78,32.72 119.82,35.76 131,35.76 132.27,37.03 C5.2 | K_ASS1.1 11.87,41.22 11.87,36.4 11.75,36.27 | v20.89,34.87 13.4,34.87 13.27,34.75
+5V_RAW
  Bottom 0.381: LM323T.1 25.46,26.24 25.46,18.49 43.37,0.58 129.73,0.58 JP3.1 132.4,3.25 132.4,8.84 JP4.1
BYPASS+
  Top 0.381: K_BYPASS_O.S2 49.97,48.84 55.18,48.84 56.32,47.7 69.53,47.7 70.68,48.84 K_BYPASS_I.S1
BYPASS-
  Top 0.381: K_BYPASS_O.S1 57.59,48.97 63.06,48.97 K_BYPASS_I.S2
EARTH
  Top 0.203: X_OUT_1.G 39.31,61.04 53.15,61.04 58.1,65.99 T1.P 70.17,65.99 75.88,71.7 127.06,71.7 132.02,66.75 | 132.02,66.75 150.3,66.75 152.21,64.85 159.83,64.85 161.73,66.75 X_IN_1.G | 132.02,66.75 131.38,66.75 X_IN_2.G 132.02,66.75
GND  (via drill 0.4)
  Top 0.381: 142.81,21.92 144.08,20.65 C26.1 144.21,20.78 147.64,20.78 149.67,22.81 159.83,22.81 159.96,22.81 | 142.81,21.92 142.68,22.05 142.68,24.21 IC1.4 | R2.2 142.68,21.79 142.81,21.92 | 159.96,33.35 155.13,33.35 C19.- | 159.96,33.35 161.1,33.35 R4.2 | 159.96,22.81 159.96,33.22 159.96,33.35 | 159.96,22.81 159.96,22.56 160.97,21.54 160.97,20.02 C25.- 161.23,19.89 172.4,8.71 VOLUME_BUS.3 | SJ3.1 111.19,17.73 108.52,17.73 SJ2.1 108.39,17.73 105.73,17.73 SJ1.1 105.47,17.73 103.7,17.73 v103.31,17.35 | JP3.3 137.35,8.84 JP4.3 | 79.57,17.73 85.79,23.95 85.79,31.06 C21.1 85.66,31.19 84.52,32.33 80.2,32.33 77.41,29.54 74.74,29.54 74.61,29.41 | 79.57,17.73 78.93,17.09 78.3,17.09 DEMUX.10 | 74.61,29.41 74.61,28.4 LED_DR.9 | 74.61,29.41 72.83,31.19 C22.1 | RL_DR.9 92.39,20.65 92.39,20.14 94.42,18.11 C20.1 94.68,17.98 95.82,16.84 100.14,16.84 101.66,18.36 v101.92,18.36 | v80.71,16.59 79.69,17.6 79.57,17.73 | v25.08,30.3 26.99,32.21 C11.2 | v118.55,20.4 116.4,20.4 v113.6,17.6
  Bottom 0.381: 137.35,20.4 137.35,20.78 R2.2 | 137.35,20.4 137.35,8.97 JP4.3 | 80.71,16.46 92.9,16.46 94.42,17.98 C20.1 | 80.71,16.46 44.64,16.46 29.02,32.08 27.11,32.08 C11.2 | C12.- 13.4,30.94 18.35,30.94 22.92,26.37 LM323T.2 22.16,27.38 v25.08,30.3 | v80.71,16.59 80.71,16.46 | v101.92,18.36 102.93,17.35 v103.31,17.35 102.93,17.6 v113.6,17.6 | v118.55,20.4 137.22,20.4 137.35,20.4
GND_AUDIO  (via drill 0.4, 0.6)
  Top 0.381: K_ASS.S1 83.38,48.97 78.93,53.42 78.93,58.75 JP1.3 | 41.21,28.4 43.5,28.4 43.62,28.27 TO_PREAMP.3 | 41.21,28.4 34.99,28.4 POT1.1 34.86,28.65 24.45,28.65 22.16,30.94 | 41.21,28.4 41.21,28.52 41.21,37.54 R1.1 41.21,37.8 41.21,40.97 47.94,47.7 47.94,52.02 53.66,57.73 58.23,57.73 60.26,59.77 60.26,60.02 RIAA.3 | IC1.2 142.56,29.41 140.91,29.41 R2.1 138.24,32.08 137.1,32.08 135.57,32.08 131.13,36.53 131.13,47.19 131.13,47.32 | 22.16,30.94 20.32,32.78 | 20.32,32.78 14.41,38.68 14.41,43.89 12,46.3 K_ASS1.P1 | 131.13,47.32 132.4,47.32 133.54,48.46 IN3.S1 | 131.13,47.32 124.78,47.32 116.27,38.81 112.84,38.81 IN4.S1 | PWR2.2 92.9,3.51 94.93,5.54 103.82,5.54 105.98,3.38 108.78,3.38 116.27,10.87 116.27,12.01 119.7,15.44 VOLUME_OUT.2 | v2.48,67.51 2.48,64.59 2.6,64.47 v8.57,58.5 | v19.75,32.21 20.26,32.72 20.32,32.78 | v18.22,24.08 18.22,27 22.03,30.81 22.16,30.94 | v112.33,50.11 112.33,47.19 v113.47,46.05
  Bottom 0.381: RIAA.3 60.39,60.02 60.39,59.77 63.56,56.59 76.9,56.59 78.93,58.62 78.93,58.75 JP1.3 | IN3.S1 133.67,48.59 135.06,49.99 139.76,49.99 141.03,48.72 146.11,48.72 IN2B.S1 146.24,48.84 147.38,49.99 160.08,49.99 161.35,48.72 161.99,48.72 | 161.99,48.72 163.89,48.72 IN1B.S2 | 117.79,29.92 114.87,32.84 114.87,35 | 117.79,29.92 119.57,28.14 TO_VOLUME.3 | 114.87,35 114.87,36.65 114.74,36.78 | 114.74,36.78 112.84,38.68 IN4.S1 | 98.3,35.83 94.55,39.57 86.68,39.57 85.79,40.46 85.79,46.56 83.5,48.84 K_ASS.S1 | 98.3,35.83 99.12,35 114.74,35 114.87,35 | VOLUME_OUT.2 119.7,15.44 117.67,17.48 117.67,29.79 117.79,29.92 | PWR.2 75.37,6.55 77.41,4.52 88.84,4.52 89.85,5.54 90.87,5.54 92.9,3.51 PWR2.2 | PWR1.2 179.77,24.33 176.21,27.89 | 176.21,27.89 164.27,39.83 162.75,39.83 161.99,40.59 161.99,48.59 161.99,48.72 | K_ASS1.P1 11.87,46.43 8.7,49.61 8.57,49.73 v8.57,58.5 | v99.76,37.29 98.36,35.89 98.3,35.83 | v18.22,24.08 v6.92,12.78 | v159.32,12.78 161.1,12.78 176.09,27.76 176.21,27.89 | v113.47,46.05 113.47,43.13 114.87,41.73 114.87,36.91 114.74,36.78 | v112.33,50.11 v112.33,57.23
  other vias: 160.59,6.43
  pour Top: -0.06,73.61 190.44,73.61 190.44,-0.56 -0.06,-0.56
  pour Bottom: -0.95,73.61 190.44,73.61 190.44,-0.56 -0.95,-0.56
GND_IN_RIAA
  Top 0.381: RCA_IN_3.SLEEVE1 81.85,64.21 76.77,69.29 RCA_IN_3.SLEEVE2 76.77,69.16 71.82,64.21 RCA_IN_3.SLEEVE
  Bottom 0.381: RIAA.4 62.93,60.02 62.93,60.27 66.87,64.21 71.69,64.21 RCA_IN_3.SLEEVE
GND_OUT_ASSYM
  Top 0.381: RCA_OUT_1.SLEEVE 9.59,64.21 14.54,69.16 RCA_OUT_1.SLEEVE2 14.67,69.16 19.62,64.21 RCA_OUT_1.SLEEVE1
  Bottom 0.381: K_ASS1.S1 11.75,48.97 9.46,51.26 9.46,64.08 RCA_OUT_1.SLEEVE
GND_OUT_SYM
  Top 0.381: K_ASS1.O1 11.87,43.76 10.6,43.76 7.68,40.84 7.68,28.78 5.78,26.87 5.52,26.87 JP2.2
  Top 0.406: X_OUT_1.1 41.08,57.86 10.86,57.86 8.32,55.32 8.32,46.05 10.6,43.76
IN_SYM+
  Top 0.381: IN4.S2 105.09,38.81 98.49,45.42 98.49,46.69 96.46,48.72 IN5.S1 | IN3.S2 125.92,48.46 124.52,48.46 118.68,42.62 109.16,42.62 105.35,38.81 IN4.S2 | K_ASS.O2 75.88,43.76 77.41,43.76 81.6,39.57 104.08,39.57 IN4.S2 | IN2A.S1 158.94,48.59 162.62,44.91 172.78,44.91 177.48,40.21 IN1A.S2
  Bottom 0.381: K_ASS.O2 75.88,43.89 77.79,45.8 77.79,46.94 75.88,48.84 K_ASS.S2 | IN2A.S1 158.81,48.59 156.15,48.59 152.46,44.91 134.94,44.91 134.81,44.78 129.73,44.78 126.05,48.46 IN3.S2
IN_SYM-
  Top 0.381: K_ASS.O1 83.5,43.89 84.01,43.89 88.71,48.59 IN5.S2 88.96,48.72 91.38,48.72 95.19,52.53 134.68,52.53 138.49,48.72 IN2B.S2 | IN2A.S2 151.32,48.72 156.4,48.72 157.67,49.99 170.24,49.99 171.51,48.72 IN1B.S1
  Bottom 0.381: IN2A.S2 151.19,48.59 148.53,48.59 147.38,47.45 139.76,47.45 138.62,48.59 IN2B.S2 | IN1B.S1 171.64,48.59 176.59,48.59 184.98,40.21 IN1A.S1
IN_VOL+
  Top 0.381: TO_VOLUME.1 106.62,22.94 103.19,19.51 100.39,19.51 94.17,25.73 94.17,31.57 91.38,34.37 70.04,34.37 64.83,39.57 55.56,39.57
  Top 0.406: 55.56,39.57 47.69,39.57 45.66,41.61 45.66,43 48.96,46.3 49.82,46.3 K_BYPASS_O.P2
  Bottom 0.381: POT1.3 34.99,33.6 35.37,33.6 48.07,46.3 49.85,46.3 K_BYPASS_O.P2 49.97,46.3
IN_VOL-
  Top 0.381: TO_VOLUME.5 115.89,33.1 113.98,35 74.49,35 69.66,39.83 68.64,39.83 65.09,43.38 65.09,44.4 64.33,45.16 58.74,45.16 57.59,46.3 K_BYPASS_O.P1
  Bottom 0.406: R1.2 45.74,45.24 48.2,47.7 54.8,47.7 56.07,46.43 57.54,46.43 K_BYPASS_O.P1
LED1  (via drill 0.4)
  Top 0.203: LED_IN1.K 186.63,70.56 186.63,66.12 LED_IN1B.K | v63.56,29.92 60.64,32.84 RLED6.2 | v71.44,22.05 71.44,18.49 v75.88,14.05 | v116.52,14.68 118.55,16.71 133.03,16.71 v138.62,11.13
  Bottom 0.203: v71.44,22.05 v63.56,29.92 | v75.88,14.05 90.23,14.05 93.15,11.13 104.08,11.13 104.84,11.89 104.84,13.03 106.49,14.68 v116.52,14.68 | v138.62,11.13 176.97,11.13 189.67,23.83 189.67,63.07 186.63,66.12 LED_IN1B.K
LED2  (via drill 0.4)
  Top 0.203: v53.91,38.05 53.91,32.33 54.55,31.7 55.44,31.7 56.45,32.72 57.72,32.72 RLED5.2 | v54.8,56.72 v54.8,50.24 | v50.99,65.86 54.67,69.55 54.67,70.94 55.94,72.21 154.37,72.21 156.02,70.56 LED_IN2B.K
  Bottom 0.203: LED_IN2.K 156.15,66.12 156.15,70.56 LED_IN2B.K | v53.91,38.05 53.91,40.08 56.58,42.75 58.86,42.75 59.5,43.38 59.5,49.35 58.61,50.24 v54.8,50.24 | v54.8,56.72 54.8,57.23 50.99,61.04 v50.99,65.86
LED3  (via drill 0.4)
  Top 0.203: LED_IN3.K LED_IN3B.K 120.59,61.04 v120.59,57.23 | v69.79,32.33 68.01,34.11 57.21,34.11 55.94,32.84 55.05,32.84 RLED4.2 | v75.37,35.89 90.11,35.89 90.49,35.51 102.04,35.51 104.2,37.67 106.49,37.67 v109.66,40.84
  Bottom 0.203: v69.79,32.33 71.82,32.33 v75.37,35.89 | v109.66,40.84 109.66,46.3 v120.59,57.23
LED4  (via drill 0.4)
  Top 0.203: LED_IN4B.K LED_IN4.K 101.66,61.16 73.6,61.16 66.1,53.67 66.1,52.02 v66.23,51.89
  Bottom 0.203: 66.1,52.02 66.1,51.89 | 66.1,51.89 66.1,44.53 64.33,42.75 62.17,42.75 61.15,41.73 61.15,38.94 59.37,37.16 59.37,32.84 58.23,31.7 54.55,31.7 53.4,32.84 52.13,32.84 RLED3.2 | v66.23,51.89 66.1,51.89
LED5  (via drill 0.4)
  Top 0.203: LED_IN5.K 87.69,70.56 87.69,66.24 LED_IN5B.K | v70.68,33.1 70.68,19.89 60.39,9.6 60.39,8.08 RLED2.2 | v79.82,42.75 82.36,45.29 84.65,45.29 86.93,47.57 86.93,60.02 v87.31,60.4
  Bottom 0.203: v70.68,33.1 70.68,33.6 v79.82,42.75 | v87.31,60.4 87.31,65.99 87.57,66.24 LED_IN5B.K
LED6  (via drill 0.4)
  Top 0.203: LED_OUT_XLR1.K 55.94,70.56 55.94,66.24 LED_OUT_XLR2.K | v50.48,69.29 50.48,67.01 v50.23,66.75 | v56.58,53.8 63.18,53.8 v66.87,50.11
  Bottom 0.203: RLED1.2 57.72,18.36 62.67,23.32 62.67,31.57 68.26,37.16 68.26,41.22 69.79,42.75 71.95,42.75 72.71,43.51 72.71,49.35 71.95,50.11 v66.87,50.11 | v50.48,69.29 52.9,71.7 53.78,71.7 54.93,70.56 55.82,70.56 LED_OUT_XLR1.K | v50.23,66.75 50.23,60.15 v56.58,53.8
LED7  (via drill 0.4)
  Top 0.203: LED_OUT_RCA1.K 25.34,70.31 25.34,66.12 LED_OUT_RCA2.K 25.34,65.99 31.69,59.64 41.47,59.64 44.64,56.46 44.64,55.32 39.94,50.62 39.94,37.16 40.32,36.78 v40.32,35.38
  Bottom 0.203: v40.32,35.38 40.32,23.83 42.35,21.79 50.36,21.79 53.78,18.36 54.93,18.36 RLED7.2
LED8
  Top 0.203: RLED8.2 52.26,8.2 52.26,11 44.13,19.13 5.52,19.13 JP2.5
LED_PWM_5V  (via drill 0.4)
  Top 0.381: R6.2 133.79,17.48 136.46,17.48 140.91,13.03 Q2.D | 53.4,65.74 53.4,66.24 LED_OUT_XLR2.A 53.53,65.61 53.53,65.35 v54.67,64.21
  Bottom 0.381: LED_OUT_XLR2.A 53.28,66.24 51.12,68.4 25.46,68.4 23.56,70.31 22.8,70.31 LED_OUT_RCA1.A 22.67,70.18 19.24,66.75 8.57,66.75 6.92,65.1 6.92,63.2 7.05,63.07 7.05,57.1 2.22,52.27 2.22,24.71 5.14,21.79 5.4,21.79 JP2.4 | 183.07,63.58 156.02,63.58 153.61,65.99 LED_IN2.A 153.48,65.86 142.18,54.56 133.16,54.56 121.98,65.74 121.98,70.31 121.98,70.43 | 183.07,63.58 183.2,63.58 185.23,65.61 185.23,66.62 184.09,67.77 184.09,70.56 LED_IN1.A | 86.17,70.82 87.19,71.83 98.62,71.83 98.74,71.7 | 86.17,70.82 85.92,70.56 85.15,70.56 LED_IN5.A | LED_IN4.A 98.74,71.7 | 121.98,70.43 117.28,70.43 115.89,71.83 98.87,71.83 98.74,71.7 | 121.98,70.43 LED_IN3.A | Q2.D 141.03,12.9 141.92,12.9 143.19,11.63 176.72,11.63 187.13,22.05 187.13,53.16 183.07,57.23 183.07,63.45 183.07,63.58 | 86.17,70.82 86.3,70.69 86.3,65.74 85.53,64.97 84.65,64.97 82.87,66.75 75.88,66.75 74.49,68.15 61.66,68.15 57.72,64.21 54.93,64.21 54.8,64.21 v54.67,64.21
LED_PWM_5V_2  (via drill 0.4)
  Top 0.381: LED_IN5B.A 85.15,66.24 LED_IN5B.A | LED_IN4B.A 103.57,70.43 98.36,65.23 98.36,64.21 95.82,61.67 89.73,61.67 85.28,66.12 LED_IN5B.A | Q1.D 147.26,16.59 R3.2 | LED_IN3B.A 121.48,66.24 120.97,66.75 117.54,66.75 | 117.54,66.75 116.9,66.75 116.9,66.62 v116.9,66.12 | v117.92,53.42 117.92,62.81 117.54,63.2 117.54,66.62 117.54,66.75 | 22.8,66.12 LED_OUT_RCA2.A 22.8,66.12 | 184.09,66.12 LED_IN1B.A 184.09,66.12 | 153.61,70.56 LED_IN2B.A 153.61,70.56 | 53.4,70.56 LED_OUT_XLR1.A 53.4,70.56
  Bottom 0.381: 154.75,67.89 154.75,69.29 153.61,70.43 LED_IN2B.A | 154.75,67.89 154.75,65.74 155.64,64.85 161.86,64.85 163.13,66.12 183.96,66.12 LED_IN1B.A | 54.55,69.29 54.55,69.42 53.4,70.56 LED_OUT_XLR1.A | 54.55,69.29 54.55,65.74 53.78,64.97 52.9,64.97 52.13,65.74 52.13,66.12 50.48,67.77 25.21,67.77 23.56,66.12 22.8,66.12 LED_OUT_RCA2.A | 54.55,69.29 54.67,69.29 73.34,69.29 75.88,71.83 79.44,71.83 85.03,66.24 LED_IN5B.A | LED_IN4B.A 105.47,69.16 108.39,69.16 111.32,66.24 111.44,66.12 v116.9,66.12 | R3.2 146.24,30.68 141.03,35.89 141.03,37.67 139.51,39.19 124.65,39.19 116.52,47.32 116.52,52.02 v117.92,53.42 | LED_IN3B.A 125.16,68.15 131.89,68.15 132.14,67.89 154.62,67.89 154.75,67.89
MOSI  (via drill 0.4)
  Top 0.203: v88.84,8.08 83.76,13.16 78.3,13.16 DEMUX.13 | JP3.2 134.81,8.84 JP4.2
  Bottom 0.203: v88.84,8.08 101.41,8.08 106.11,3.38 124.4,3.38 131.76,10.74 133.03,10.74 134.81,8.97 JP4.2 | VOLUME_BUS.2 168.59,5.03 168.59,4.9 165.04,1.35 136.59,1.35 JP3.2
MUX_CS  (via drill 0.4)
  Top 0.203: DEMUX.11 78.3,15.7 81.85,15.7 87.44,10.11 105.98,10.11 106.11,10.24 108.78,10.24 109.03,9.98 v110.68,9.98
  Bottom 0.203: JP3.6 144.97,8.71 JP4.6 144.97,8.84 143.83,7.7 136.84,7.7 136.08,8.46 136.08,9.47 134.3,11.25 131.64,11.25 130.49,10.11 110.81,10.11 v110.68,9.98
N$1
  Top 0.203: DEMUX.18 87.95,15.7 90.11,15.7 91.38,14.43 R_DEMUX.2
N$2
  Top 0.203: LED_DR.17 65.21,19.38 64.71,19.38 57.72,12.4 57.72,8.2 RLED1.1
N$3
  Bottom 0.381: IN3.P2 125.92,46.05 123.38,48.59 123.38,55.7 115,64.08 RCA_IN_1.TIP
N$4
  Bottom 0.203: R4.1 161.1,23.19 158.43,23.19 155.13,26.49 C1.2
N$5
  Top 0.381: PWR.1 72.83,6.55 78.42,0.97 93.41,0.97 95.44,3 PWR2.1 95.57,2.87 97.85,0.58 181.8,0.58 186.63,5.41 186.63,24.59 184.34,26.87 PWR1.1
N$6
  Top 0.203: LED_DR.18 65.21,18.11 65.21,15.06 58.86,8.71 58.86,7.7 58.1,6.93 56.2,6.93 55.05,8.08 RLED7.1
N$7  (via drill 0.4)
  Top 0.203: v114.87,15.57 120.97,21.67 136.59,21.67 141.67,26.75 142.56,26.75 IC1.3
  Bottom 0.203: v114.87,15.57 104.84,15.57 102.55,13.28 101.16,13.28 98.87,15.57 41.97,15.57 25.84,31.7 25.84,32.59 26.61,33.35 28.51,33.35 30.8,31.06 32.32,31.06 POT1.2
N$8
  Top 0.203: LED_DR.16 65.21,20.65 62.8,20.65 60.39,18.24 RLED2.1
N$9
  Top 0.203: IC1.7 150.3,29.41 153.73,29.41 155,30.68 C19.+
N$10
  Top 0.203: JP3.10 155.13,8.84 JP4.10 155.26,8.97 155.77,9.47 155.77,12.9 SJ9.2
N$11
  Top 0.203: DEMUX.8 78.17,19.51 76.52,19.51 75.25,18.24 74.74,18.24 LED_DR.1
N$12
  Top 0.203: DEMUX.7 78.17,20.78 76.52,20.78 75.25,19.51 74.74,19.51 LED_DR.2
N$13
  Top 0.203: DEMUX.6 78.17,22.05 76.52,22.05 75.25,20.78 74.74,20.78 LED_DR.3
N$14
  Top 0.203: DEMUX.5 78.17,23.32 76.52,23.32 75.25,22.05 74.74,22.05 LED_DR.4
N$15
  Top 0.203: DEMUX.4 78.17,24.59 76.52,24.59 75.25,23.32 74.74,23.32 LED_DR.5
N$16
  Top 0.203: DEMUX.3 78.17,25.86 76.52,25.86 75.25,24.59 74.74,24.59 LED_DR.6
N$17
  Top 0.203: DEMUX.2 78.17,27.13 76.52,27.13 75.25,25.86 74.74,25.86 LED_DR.7
N$18
  Top 0.203: DEMUX.1 78.17,28.4 76.52,28.4 75.25,27.13 74.74,27.13 LED_DR.8
N$19
  Top 0.203: LED_DR.15 65.21,21.92 62.55,21.92 61.28,20.65 54.17,20.65 52.13,22.68 RLED3.1
N$20  (via drill 0.4)
  Top 0.381: PWR.3 86.8,6.81 PWR2.3 | PWR1.3 184.09,12.52 178.88,7.32 178.88,4.9 175.32,1.35 100.14,1.35 v100.01,1.47
  Bottom 0.381: 100.14,1.35 v100.01,1.47 94.68,6.81 PWR.3
N$21
  Top 0.381: RCA_IN_2.SLEEVE2 RCA_IN_2.SLEEVE
  Bottom 0.381: IN4.P1 112.71,36.27 100.9,48.08 RCA_IN_2.SLEEVE1 100.77,64.34 RCA_IN_2.SLEEVE2
N$22
  Top 0.381: IN2A.P1 158.81,46.18 153.73,46.18 152.46,47.45 149.92,47.45 148.15,49.23 148.15,55.7 143.45,60.4 X_IN_2.2
N$23
  Top 0.381: IN2B.P2 138.62,46.18 140.53,48.08 140.53,55.58 139.64,56.46 X_IN_2.3
N$24
  Top 0.381: X_IN_2.1 135.83,61.04 137.1,61.04 144.08,54.05 144.08,48.21 146.11,46.18 IN2B.P1 146.24,46.18 151.19,46.18 IN2A.P2
N$25
  Top 0.203: LED_DR.14 65.21,23.19 63.18,23.19 61.15,21.16 56.45,21.16 55.05,22.56 RLED4.1
N$26
  Top 0.203: LED_DR.13 65.21,24.46 63.82,24.46 61.02,21.67 58.74,21.67 57.85,22.56 RLED5.1
N$27
  Top 0.203: LED_DR.12 65.21,25.73 63.56,25.73 60.64,22.81 RLED6.1
N$29
  Bottom 0.381: IN4.P2 105.09,36.27 98.49,42.88 98.49,61.42 95.82,64.08 RCA_IN_2.TIP
N$30
  Top 0.203: SJ1.2 105.73,16.21 105.73,12.9 106.11,12.52 RARR4.2 105.73,12.78 104.08,11.13 103.19,11.13 102.43,11.89 87.95,11.89 DEMUX.15
N$31
  Top 0.203: SJ2.2 108.52,16.21 108.52,12.65 108.65,12.52 RARR4.3 108.52,12.52 107.12,11.13 106.36,11.13 105.85,10.62 87.57,10.62 86.68,11.51 86.68,12.4 87.44,13.16 87.82,13.16 DEMUX.16
N$32
  Top 0.381: RCA_IN_1.SLEEVE 109.92,64.21 115,69.29 RCA_IN_1.SLEEVE2
  Bottom 0.381: IN3.P1 133.54,46.05 124.02,55.58 124.02,60.27 120.08,64.21 RCA_IN_1.SLEEVE1 119.95,64.34 115,69.29 RCA_IN_1.SLEEVE2
N$33
  Top 0.381: IN1A.P2 177.48,37.67 179.51,39.7 179.51,54.81 173.93,60.4 X_IN_1.2
N$34
  Bottom 0.381: IN1B.P1 171.51,46.18 169.61,48.08 169.61,56.08 169.99,56.46 X_IN_1.3
N$35
  Top 0.203: 111.32,14.05 111.32,12.52 RARR4.4 | 111.32,14.05 111.32,16.21 SJ3.2 | 111.32,14.05 112.59,15.32 112.59,18.62 112.33,18.87 103.7,18.87 97.6,12.78 90.49,12.78 88.84,14.43 87.95,14.43 DEMUX.17
N$40
  Bottom 0.381: 166.18,48.34 164.02,46.18 IN1B.P2 | 166.18,48.34 166.18,61.04 X_IN_1.1 | IN1A.P1 184.98,37.67 182.56,37.67 178.75,41.48 176.21,41.48 172.78,44.91 169.61,44.91 166.31,48.21 166.18,48.34
N$42
  Top 0.381: K_ASS2.O2 29.65,43.89 35.24,49.48 35.24,55.7 35.37,55.83 X_OUT_1.2
N$55
  Bottom 0.406: K_ASS2.S2 28.4,48.96 27.11,50.24 27.11,54.56 25.34,56.34 17.72,56.34 14.67,59.39 14.67,63.96 RCA_OUT_1.TIP
N$56
  Top 0.203: DEMUX.21 87.95,19.63 89.47,19.63 91.76,21.92 92.27,21.92 RL_DR.8
N$59
  Top 0.203: DEMUX.22 87.95,20.9 89.47,20.9 91.76,23.19 92.27,23.19 RL_DR.7
N$65
  Top 0.203: DEMUX.23 87.95,22.17 89.47,22.17 91.76,24.46 92.27,24.46 RL_DR.6
N$67
  Top 0.203: DEMUX.24 87.95,23.44 89.47,23.44 91.76,25.73 92.27,25.73 RL_DR.5
N$68
  Top 0.203: DEMUX.25 87.95,24.71 89.47,24.71 91.76,27 92.27,27 RL_DR.4
N$69
  Top 0.203: DEMUX.26 87.95,25.98 89.47,25.98 91.76,28.27 92.27,28.27 RL_DR.3
N$70
  Top 0.203: DEMUX.27 87.95,27.25 89.47,27.25 91.76,29.54 92.27,29.54 RL_DR.2
N$71
  Top 0.203: DEMUX.28 87.95,28.52 89.47,28.52 91.76,30.81 92.27,30.81 RL_DR.1
N$72
  Top 0.381: K_ASS2.O1 37.27,43.89 39.31,45.92 39.31,55.83 X_OUT_1.3
N$83
  Top 0.203: JP3.9 152.59,8.84 JP4.9 152.72,8.97 152.72,12.9 SJ8.2
OUT_EXT+
  Bottom 0.381: K_OUT_SEL.S2 13.27,45.16 10.6,45.16 7.05,41.61 7.05,30.94 5.52,29.41 JP2.1
OUT_EXT-
  Bottom 0.381: K_OUT_SEL.S1 18.22,42.49 13.27,42.49 13.14,42.62 10.6,42.62 7.68,39.7 7.68,26.24 5.78,24.33 5.52,24.33 JP2.3
OUT_INT+
  Top 0.381: K_OUT_SEL.O2 22.03,43.76 23.3,45.03 28.26,45.03 29.53,46.3 K_ASS2.P2
OUT_INT-
  Bottom 0.381: K_OUT_SEL.O1 26.99,43.76 28.38,45.16 36,45.16 37.15,46.3 K_ASS2.P1
OUT_VOL+
  Bottom 0.381: K_OUT_SEL.P2 19.49,46.3 23.3,50.11 25.97,50.11 28.38,47.7 30.92,47.7 36,52.78 77.03,52.78 80.71,49.1 80.71,40.46 82.36,38.81 85.41,38.81 92.27,31.95 93.79,31.95 100.01,25.73 100.01,19.89 100.39,19.51 113.09,19.51 119.7,12.9 VOLUME_OUT.1
OUT_VOL-
  Bottom 0.381: K_OUT_SEL.P1 21.78,43.51 21.78,34.87 46.42,10.24 105.98,10.24 106.62,10.87 120.71,10.87 122.24,12.4 122.24,15.95 120.21,17.98 VOLUME_OUT.3
PREAMP1_IN+
  Bottom 0.381: K_BYPASS_I.O1 70.68,43.76 69.53,43.76 65.98,40.21 65.98,35.64 56.07,25.73 43.75,25.73 TO_PREAMP.2
PREAMP1_IN-
  Bottom 0.381: K_BYPASS_I.O2 63.06,43.76 61.91,43.76 59.88,41.73 59.88,38.43 55.69,34.24 47.43,34.24 44.01,30.81 43.75,30.81 TO_PREAMP.4
PREAMP1_OUT+
  Bottom 0.381: 45.91,40.97 48.7,43.76 49.85,43.76 K_BYPASS_O.O2
  Bottom 0.406: TO_PREAMP.1 42.57,23.11 40.83,24.84 40.83,33.99 45.91,39.07 45.91,40.97
PREAMP1_OUT-
  Bottom 0.381: K_BYPASS_O.O1 57.47,43.76 56.07,43.76 51.12,38.81 49.21,38.81 43.75,33.35 TO_PREAMP.5
PWM
  Top 0.203: JP3.7 147.51,8.84 JP4.7 147.51,8.97 147.51,10.87 143.57,14.81 142.3,14.81 Q2.G
PWM2
  Top 0.203: JP3.8 150.05,8.84 JP4.8 150.05,8.97 148.53,10.49 Q1.G
RIAA_IN+
  Top 0.381: RIAA.2 57.85,60.02 57.85,60.27 59.88,62.31 70.17,62.31 70.8,61.67 74.36,61.67 76.77,64.08 RCA_IN_3.TIP
RIAA_OUT+
  Bottom 0.381: 72.07,67.39 74.23,65.23 74.23,64.34 76.9,61.67 84.77,61.67 90.87,55.58 90.87,51.64 96.33,46.18 IN5.P1 | 55.31,60.27 55.31,60.02 RIAA.1
  Bottom 0.406: 55.31,60.27 55.31,60.91 58.1,63.7 64.96,63.7 66.99,65.74 68.52,65.74 70.29,67.51 71.95,67.51 72.07,67.39
RIAA_OUT-
  Bottom 0.381: IN5.P2 88.71,46.18 85.41,49.48 85.41,60.15 84.52,61.04 66.48,61.04 65.47,60.02 RIAA.5
RO_ASYM  (via drill 0.4)
  Top 0.203: K_ASS1.10 4.38,41.22 4.38,38.68 5.52,37.54 C16.2 5.52,37.41 5.52,32.08 3.37,29.92 3.37,21.16 4,20.52 v41.85,20.52 | v95.06,29.41 96.46,30.81 101.66,30.81 RL_DR.18
  Bottom 0.203: K_ASS2.10 29.65,41.22 29.65,38.68 30.8,37.54 C15.2 33.46,34.87 33.46,28.4 41.59,20.27 | v95.06,29.41 93.66,29.41 83.88,19.63 63.44,19.63 60.77,16.97 44.89,16.97 41.59,20.27 | 41.59,20.27 v41.85,20.52
RO_OUT  (via drill 0.4)
  Top 0.203: K_OUT_SEL.10 16.95,38.56 C10.2 18.22,36.02 24.7,29.54 36.89,29.54 v37.15,29.29 | LED_DR.11 65.21,27 54.8,27 50.99,23.19 50.99,19.63 52.26,18.36 RLED8.1
  Bottom 0.203: v37.15,29.29 37.15,26.37 45.15,18.36 52.26,18.36 RLED8.1
RS_ASYM  (via drill 0.4)
  Top 0.203: K_ASS.10 75.88,41.22 75.88,38.68 77.03,37.54 C7.2 | v98.23,22.94 99.38,22.94 100.27,22.05 101.66,22.05 RL_DR.11 | v85.41,22.3 v85.41,19.38
  Bottom 0.203: v98.23,22.94 88.96,22.94 v85.41,19.38 | v85.41,22.3 85.41,24.84 79.69,30.56 79.69,34.75 80.45,35.51 80.45,36.02 79.06,37.41 77.15,37.41 C7.2
RS_BYPASS  (via drill 0.4)
  Top 0.203: K_BYPASS_O.10 49.97,41.22 55.31,41.22 56.32,40.21 62.04,40.21 63.06,41.22 K_BYPASS_I.10 | C9.2 51.24,37.54 52.26,37.54 53.66,38.94 62.93,38.94 64.33,37.54 C8.1 64.45,37.41 65.34,37.41 68.9,33.86 71.18,33.86 71.69,33.35 71.69,30.68 72.2,30.18 v72.2,18.87 | v99.12,23.83 99.63,23.32 101.66,23.32 RL_DR.12
  Bottom 0.203: K_BYPASS_I.10 63.18,41.22 63.18,38.68 64.33,37.54 C8.1 | v99.12,23.83 88.71,23.83 83.76,18.87 v72.2,18.87
RS_IN1  (via drill 0.4)
  Top 0.203: 164.47,36.46 165.16,37.16 C6.1 | 164.47,36.46 164.02,36.02 152.84,36.02 144.97,28.14 142.43,28.14 141.03,26.75 118.55,26.75 116.9,28.4 111.32,28.4 107.51,24.59 101.79,24.59 RL_DR.13 | 170.56,30.37 164.53,36.4 164.47,36.46 | 170.56,30.37 172.15,28.78 C14.1 | v172.78,32.59 170.62,30.43 170.56,30.37
  Bottom 0.203: IN1A.10 177.36,32.59 v172.78,32.59 172.4,32.59 164.02,40.97 IN1B.10
RS_IN2  (via drill 0.4)
  Top 0.203: v131.89,29.29 111.57,29.29 108.14,25.86 101.79,25.86 RL_DR.14 | 138.81,38.24 139.76,37.29 C13.1 | 138.81,38.24 138.62,38.43 138.62,40.97 IN2B.10 | C4.1 152.46,37.29 146.37,37.29 145.35,38.3 138.87,38.3 138.81,38.24
  Bottom 0.203: IN2A.10 151.32,40.97 151.32,38.43 152.46,37.29 C4.1 | v131.89,29.29 139.76,37.16 C13.1
RS_IN3
  Top 0.203: 126.11,35.95 127.19,37.03 C5.1 | 126.11,35.95 121.98,31.83 118.55,31.83 116.78,30.05 107.89,30.05 104.97,27.13 101.79,27.13 RL_DR.15 | IN3.10 126.05,40.84 126.05,36.02 126.11,35.95
RS_IN4
  Top 0.203: 101.79,28.27 RL_DR.16 101.79,28.4 102.43,28.4 105.09,31.06 IN4.10
  Bottom 0.203: C3.1 106.62,27.38 106.62,29.67 105.22,31.06 IN4.10
RS_IN5  (via drill 0.4)
  Top 0.203: C2.1 90.61,36.02 95.06,36.02 96.46,37.41 96.71,37.67 v96.71,38.68 | v97.35,29.67 101.66,29.67 RL_DR.17
  Bottom 0.203: IN5.10 88.84,40.97 94.17,40.97 96.33,38.81 96.46,38.81 96.58,38.81 v96.71,38.68 | v97.35,29.67 96.96,29.67 C2.1
SCK  (via drill 0.4)
  Top 0.203: 101.16,7.32 v101.03,7.32 81.22,7.32 77.03,11.51 77.03,13.67 77.79,14.43 78.17,14.43 DEMUX.12 | VOLUME_BUS.5 176.21,5.03 176.21,4.9 173.16,1.85 143.7,1.85 JP3.5 142.56,3.12 142.56,8.84 JP4.5
  Bottom 0.203: JP3.5 141.16,4.39 137.6,4.39 133.54,8.46 133.54,9.47 132.78,10.24 131.89,10.24 124.52,2.87 105.98,2.87 101.54,7.32 101.16,7.32 v101.03,7.32
SELECTED+
  Top 0.381: K_ASS.P2 75.88,46.43 77.79,48.34 77.79,57.23 76.39,58.62 76.39,58.75 JP1.2
SELECTED-
  Bottom 0.381: K_ASS.P1 83.38,46.43 81.34,48.46 81.34,58.62 81.47,58.75 JP1.4
TO_PREAMP+
  Top 0.381: K_BYPASS_I.P1 70.8,46.43 73.72,49.35 73.72,58.62 73.85,58.75 JP1.1
TO_PREAMP-
  Top 0.381: K_BYPASS_I.P2 63.18,46.3 68.26,46.3 69.41,45.16 79.57,45.16 82.11,47.7 84.65,47.7 85.41,48.46 85.41,57.35 84.01,58.75 JP1.5
VOL_CS  (via drill 0.4)
  Top 0.203: JP3.4 139.89,8.84 JP4.4 | VOLUME_BUS.4 173.67,5.03 173.67,4.9 172.4,3.63 v157.54,3.63 157.42,3.63
  Bottom 0.203: JP3.4 141.16,1.85 155.64,1.85 157.42,3.63 v157.54,3.63
VU_METER
  Top 0.203: 155,14.55 155.77,14.55 SJ9.1 155,14.55 | 155,14.55 152.72,14.55 SJ8.1 | 155,14.55 155,21.41 C1.1
  Bottom 0.203: IC1.5 150.3,24.21 152.34,24.21 155,21.54 C1.1

### Text on the board
tValues: 1 | 1. +5V Unreg / 2. MOSI / 3. GND / 4. VOL_CS / 5. SCK / 6. MUX_CS / 7. PWM / 8. PWM2 / 9. VU1 / 10. VU2